# EAGLE design board (EAGLE 7.6.0)
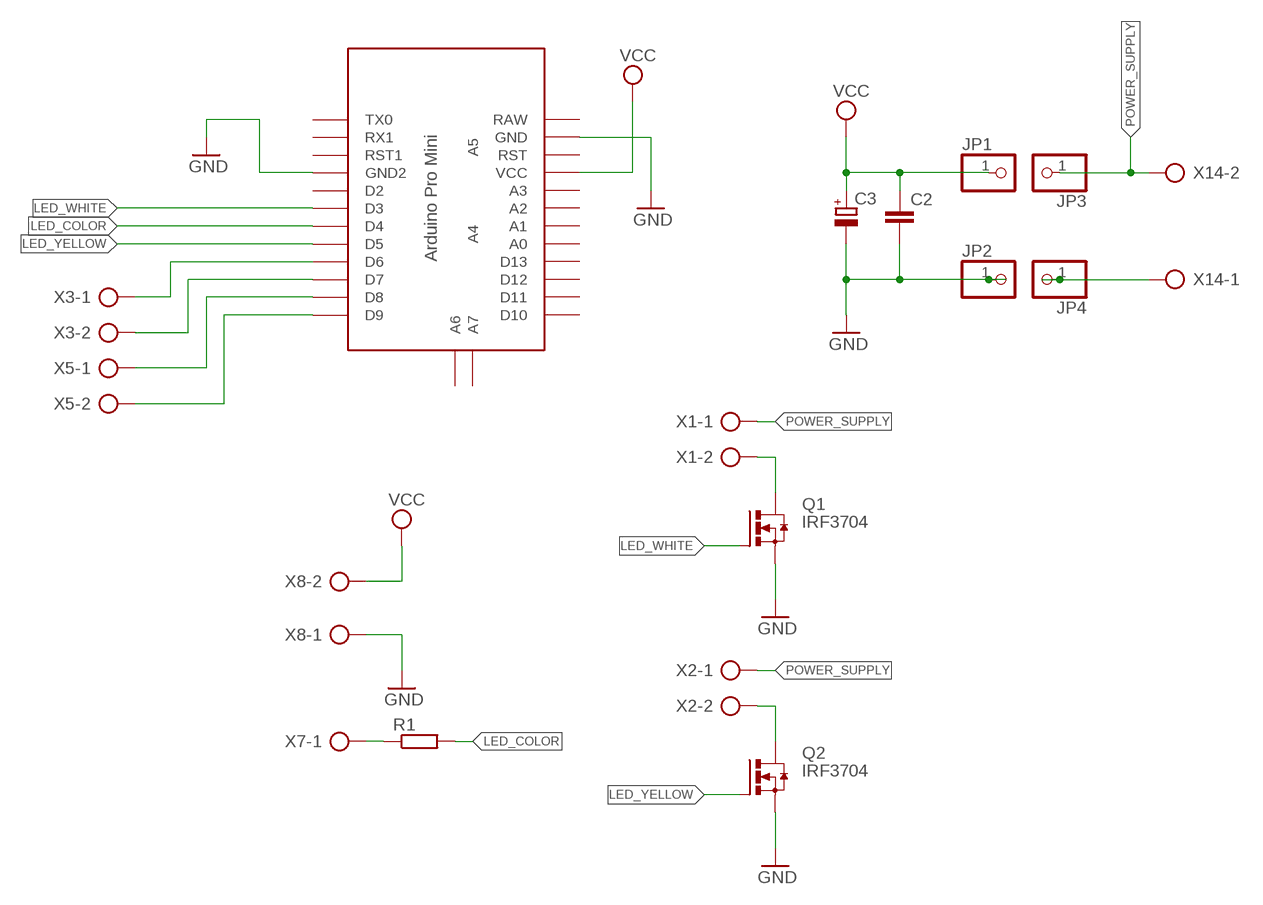
[diagram p0: schematic, sheet 1]

## Parts
C2  C-EU050-025X075  [C050-025X075]
C3  CPOL-EUE3.5-8  [E3,5-8]
JP1  PINHD-1X1  [1X01]
JP2  PINHD-1X1  [1X01]
JP3  PINHD-1X1  [1X01]
JP4  PINHD-1X1  [1X01]
Q1  IRF3704  [TO220AH]
Q2  IRF3704  [TO220AH]
R1  R-EU_0204/7  [0204/7]
U$1  ABK-PRO-MINI  [ABK-PRO-MINI]
X1  AK500/2-H  [AK500/2-H]
X2  AK500/2-H  [AK500/2-H]
X3  AK500/2-H  [AK500/2-H]
X5  AK500/2-H  [AK500/2-H]
X7  AK500/2-H  [AK500/2-H]
X8  AK500/2-H  [AK500/2-H]
X14  AK500/2-H  [AK500/2-H]

## Nets
GND: C2.2 C3.- JP2.1 JP4.1 Q1.E(S) Q2.E(S) U$1.GND U$1.GND1(GND2) X8.1 X14.1
LED_COLOR: R1.2 U$1.D4
LED_WHITE: Q1.B(G) U$1.D3
LED_YELLOW: Q2.B(G) U$1.D5
N$1: U$1.D9 X5.2
N$3: Q1.C(D) X1.2
N$4: Q2.C(D) X2.2
N$5: R1.1 X7.1
N$9: U$1.D6 X3.1
N$10: U$1.D7 X3.2
N$11: U$1.D8 X5.1
POWER_SUPPLY: JP3.1 X1.1 X2.1 X14.2
VCC: C2.1 C3.+ JP1.1 U$1.VCC X8.2
Unconnected: U$1.A0 U$1.A1 U$1.A2 U$1.A3 U$1.A4 U$1.A5 U$1.A6 U$1.A7 U$1.D2 U$1.D10 U$1.D11 U$1.D12 U$1.D13 U$1.RAW U$1.RST U$1.RST1 U$1.RX1 U$1.TX0 X7.2

## Library data of the parts
C2 = resistor:C-EU: CAPACITOR, European symbol
C3 = resistor:CPOL-EU: POLARIZED CAPACITOR, European symbol
JP1-JP4 = pinhead:PINHD-1X1: PIN HEADER
Q1 Q2 = transistor-power:IRF3704: SMPS MOSFET HEXFET® Power MOSFET Source: http://www.irf.com/product-info/datasheets/data/irf3704.pdf
R1 = rcl:R-EU_: RESISTOR, European symbol
U$1 = Arduino-clone:ABK-PRO-MINI: ABK Pro-Mini Arduino Clone
X1-X3 X5 X7 X8 X14 = con-ptr500:AK500/2-H: CONNECTOR Aug. 2004 / PTR Meßtechnik: Die Bezeichnung der Serie AK505 wurde geändert. Es handelt sich hierbei um AK500 in horizontaler Ausführung.; OC_FARNELL: unknown; OC_NEWARK: unknown

## Board
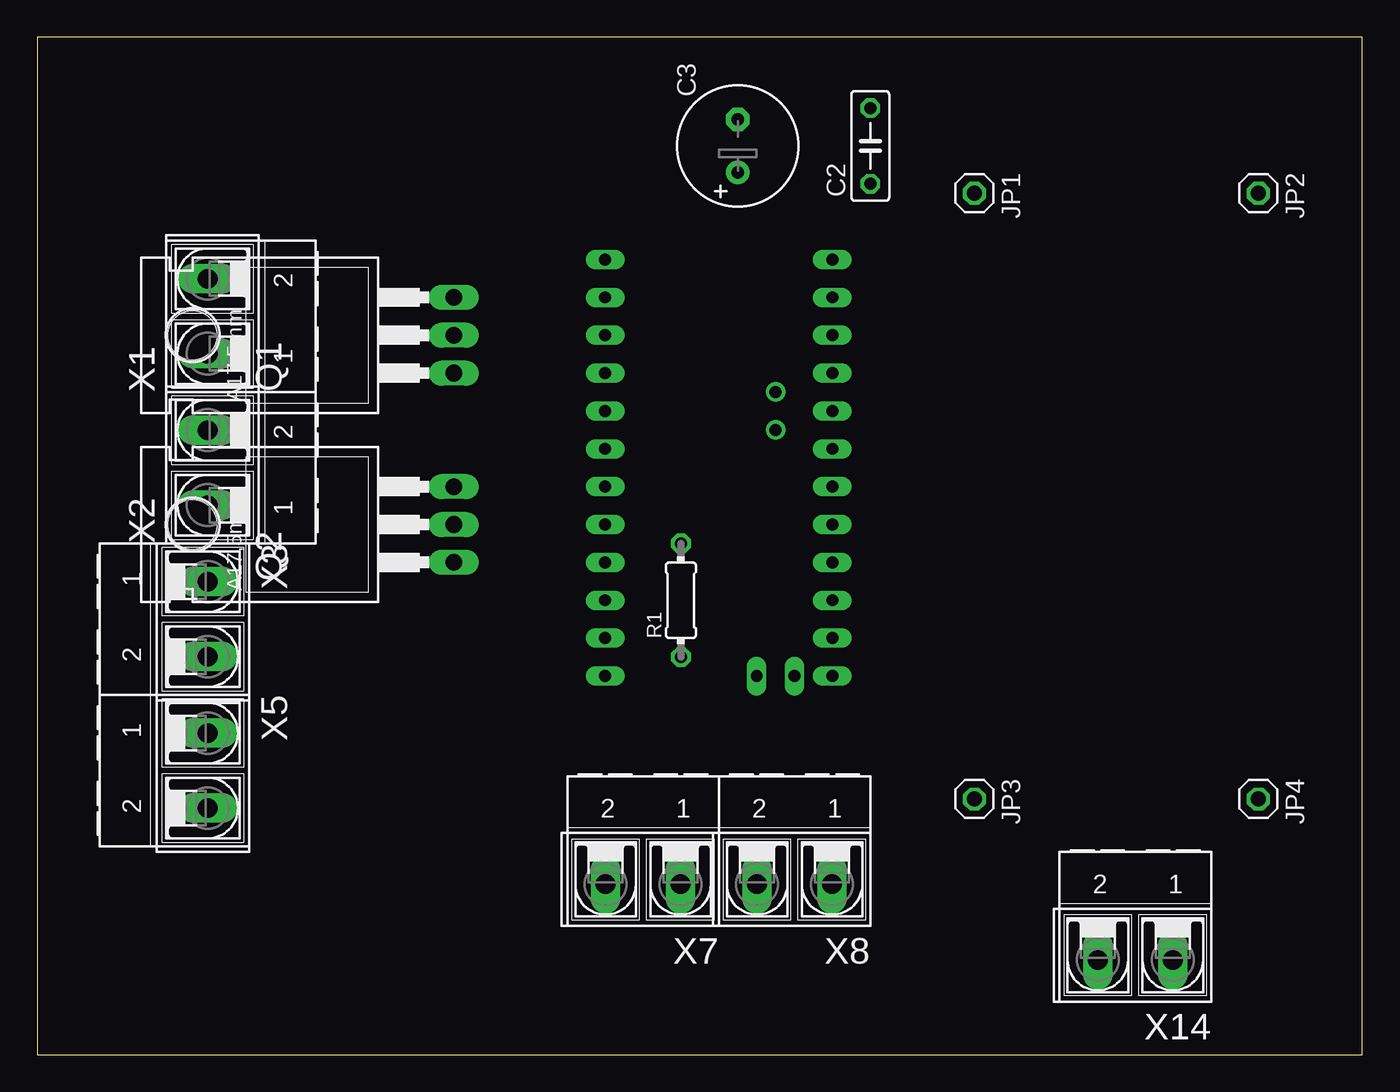
[diagram p1: board, top side]
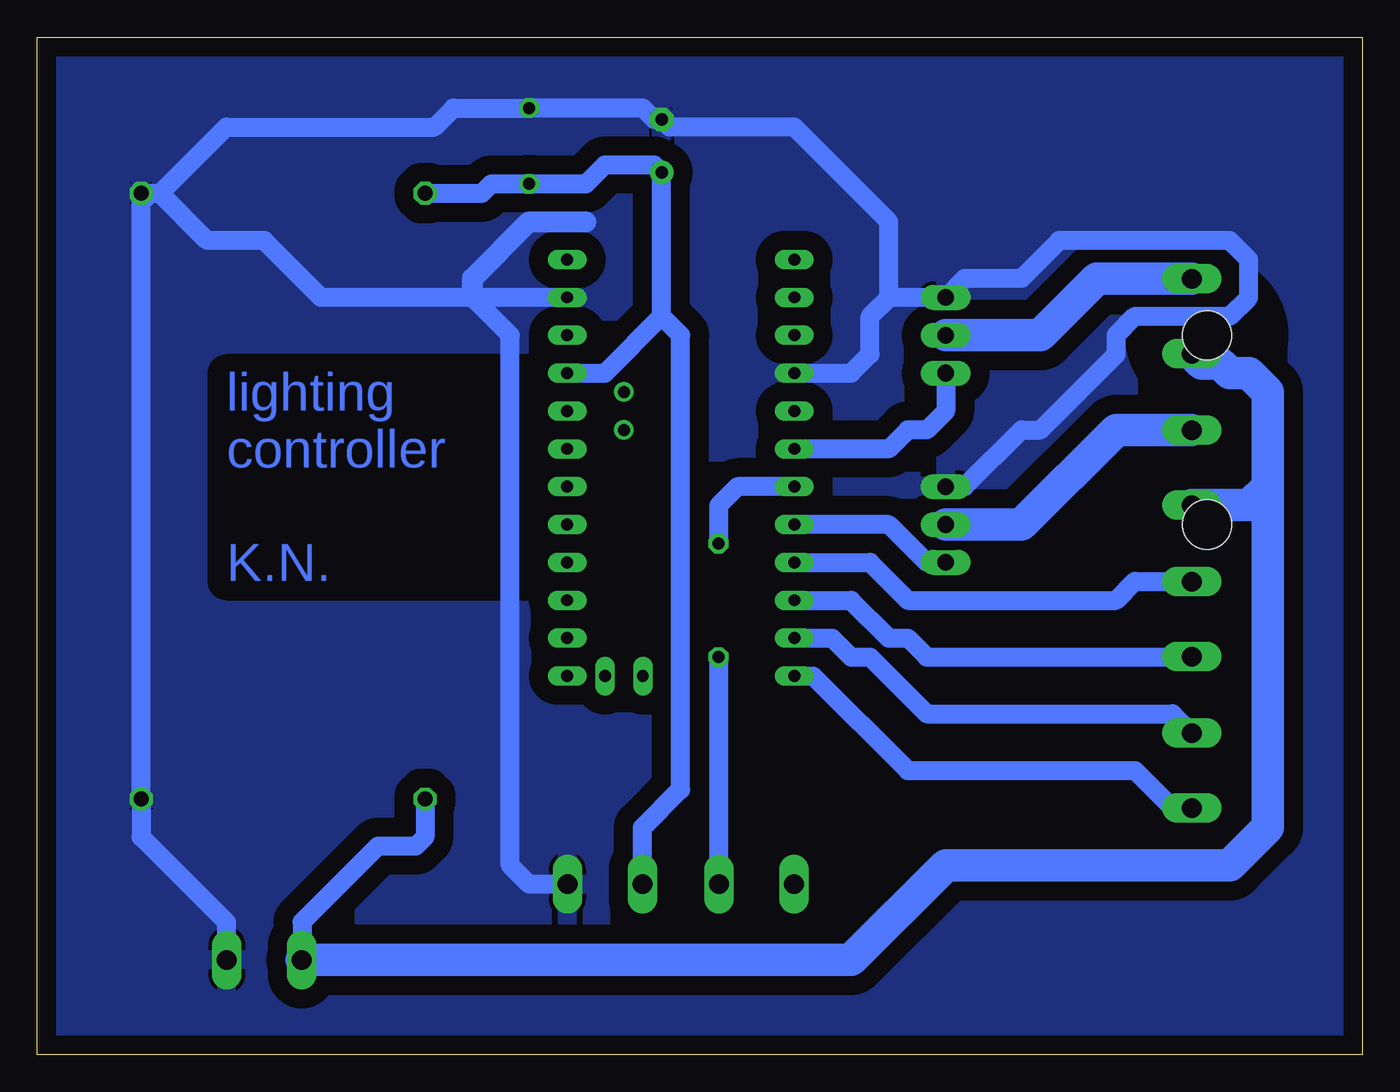
[diagram p2: board, bottom side, seen from below]

Size 88.88 x 68.25 mm. Coordinates in mm from the lower left corner, seen from the top.
Outline: 0,0 88.88,0 88.88,68.25 0,68.25 0,0
Copper layers (1*16): Top 0.035mm / dielectric 1.5mm / Bottom 0.035mm
Design rules "default": minimum track width 10mil, minimum drill 24mil, track to track 8mil, track to pad 8mil, pad to pad 8mil, via to via 8mil, smd to smd 8mil, copper to edge 40mil, drill to drill 8mil, minimum pad ring 10mil, minimum via ring 8mil, stop-mask expansion 4mil, vias tented up to drill 0mil, thermal gap 10mil

### Footprints (pad centres in the part's own frame; a part is rotated, then mirrored left to right if it is on the bottom)
C050-025X075 = drill 0.813 octagon: 1 -2.54,0; 2 2.54,0
E3,5-8 = drill 0.813 pad 1.6: + -1.778,0 | drill 0.813 pad 1.6 octagon: - 1.778,0
1X01 = drill 1.016 octagon: 1 0,0
TO220AH = drill 1.118 long: B -2.54,-6.35; C 0,-6.35; E 2.54,-6.35 | hole 3.302: 0,11.176
0204/7 = drill 0.813 octagon: 1 -3.81,0; 2 3.81,0
ABK-PRO-MINI = drill 0.8 long: A0 10.16,-3.81; A1 10.16,-6.35; A2 10.16,-8.89; A3 10.16,-11.43; A6 5.08,-21.59; A7 7.62,-21.59; D2 -5.08,-3.81; D3 -5.08,-6.35; D4 -5.08,-8.89; D5 -5.08,-11.43; D6 -5.08,-13.97; D7 -5.08,-16.51; D8 -5.08,-19.05; D9 -5.08,-21.59; D10 10.16,-21.59; D11 10.16,-19.05; D12 10.16,-16.51; D13 10.16,-13.97; GND 10.16,3.81; GND1 -5.08,-1.27; RAW 10.16,6.35; RST 10.16,1.27; RST1 -5.08,1.27; RX1 -5.08,3.81; TX0 -5.08,6.35; VCC 10.16,-1.27 | drill 0.8: A4 6.35,-5.08; A5 6.35,-2.54
AK500/2-H = drill 1.321 long: 1 -2.515,0; 2 2.515,0

### Placement (x,y rotation side)
C2  55.88,60.96 90 top
C3  46.99,60.96 90 top
JP1  62.87,57.78 270 top
JP2  81.92,57.78 270 top
JP3  62.87,17.14 270 top
JP4  81.92,17.14 270 top
Q1  21.59,48.26 90 top
Q2  21.59,35.56 90 top
R1  43.18,30.48 90 top
U$1  43.18,46.99 0 top
X1  11.43,49.53 90 top
X2  11.43,39.37 90 top
X3  11.43,29.21 270 top
X5  11.43,19.05 270 top
X7  40.64,11.43 180 top
X8  50.8,11.43 180 top
X14  73.66,6.35 180 top

### Tracks (layer width: path | path; a pad name or v marks a point on that pad's centre or on a via)
GND
  Bottom 1.27: Q2.E 26.67,38.1 22.86,41.91 21.59,41.91 16.51,46.99 16.51,48.26 15.24,49.53 8.89,49.53 7.62,50.8 7.62,53.34 8.89,54.61 20.32,54.61 22.86,52.07 26.67,52.07 Q1.E 31.75,50.8 | X14.1 76.2,6.38 76.2,8.89 81.92,14.61 JP4.1 81.92,57.15 81.28,57.78 | JP2.1 81.28,57.78 | 81.28,57.78 80.64,57.78 | 80.64,57.78 76.2,62.23 62.23,62.23 60.96,63.5 C2.2 48.26,63.5 47.5,62.74 C3.- 46.48,62.23 38.1,62.23 31.75,55.88 31.75,50.8 | U$1.GND 59.69,50.8 | 59.69,50.8 69.85,50.8 73.66,54.61 77.47,54.61 80.64,57.78 | U$1.GND1 34.29,45.72 33.02,46.99 33.02,49.53 31.75,50.8 | X8.1 55.88,11.43 57.15,12.7 57.15,48.26 59.69,50.8
  Bottom 1.422: 59.69,50.8 59.69,52.07 55.88,55.88 52.07,55.88
  pour Bottom (isolate 1.27): 0,0 88.9,0 88.9,1.27 88.9,68.58 0,68.58
LED_COLOR
  Bottom 1.27: U$1.D4 41.91,38.1 43.18,36.83 R1.2
LED_WHITE
  Bottom 1.27: Q1.B 27.94,43.18 29.21,41.91 30.48,41.91 31.75,40.64 U$1.D3
LED_YELLOW
  Bottom 1.27: Q2.B 29.21,33.02 31.75,35.56 U$1.D5
N$1
  Bottom 1.27: U$1.D9 36.83,25.4 30.48,19.05 15.24,19.05 12.7,16.51 11.46,16.51 X5.2
N$3
  Bottom 2.184: X1.2 17.8,52.05 21.59,48.26 Q1.C
N$4
  Bottom 1.27: 11.46,41.91 X2.2
  Bottom 2.184: Q2.C 22.86,35.56 16.51,41.91 11.46,41.91
N$5
  Bottom 1.27: R1.1 43.18,11.46 X7.1
N$9
  Bottom 1.27: U$1.D6 33.02,33.02 30.48,30.48 16.51,30.48 15.24,31.75 11.46,31.75 X3.1
N$10
  Bottom 1.27: U$1.D7 34.29,30.48 31.75,27.94 30.48,27.94 29.21,26.67 11.46,26.67 X3.2
N$11
  Bottom 1.27: U$1.D8 35.56,27.94 34.29,26.67 33.02,26.67 29.21,22.86 12.72,22.86 X5.1
POWER_SUPPLY
  Bottom 1.27: JP3.1 62.87,14.61 63.5,13.97 66.04,13.97 71.12,8.89 71.12,6.38 X14.2
  Bottom 2.184: X14.2 34.29,6.35 27.94,12.7 8.89,12.7 6.35,15.24 6.35,38.1 | 6.35,38.1 6.35,44.45 7.62,45.72 8.89,45.72 9.53,46.35 10.77,46.35 X1.1 | X2.1 7.59,36.85 6.35,38.1
VCC
  Bottom 1.27: JP1.1 59.05,57.78 58.42,58.42 C2.1 52.07,58.42 50.8,59.69 47.5,59.69 C3.+ 46.99,49.53 | U$1.VCC 50.8,45.72 46.99,49.53 | X8.2 48.28,15.21 45.72,17.78 45.72,48.26 46.99,49.53

### Text on the board
Bottom: lighting / controller / / K.N.